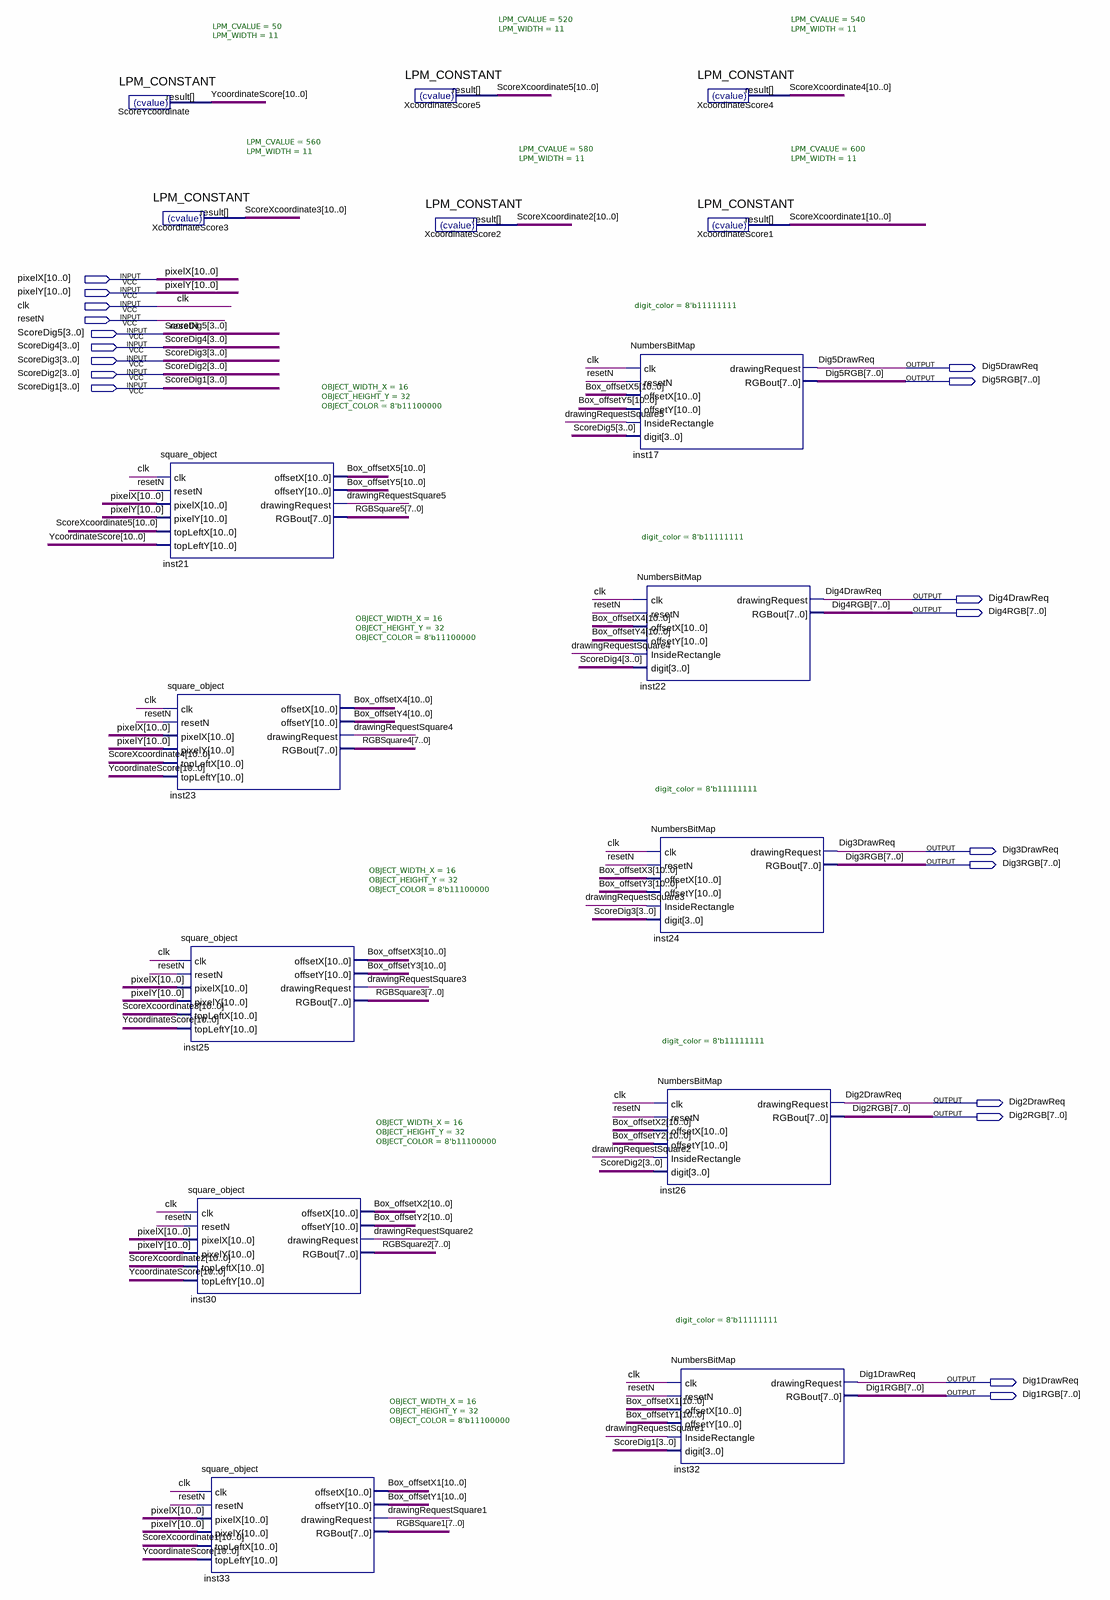
[diagram p0: schematic sheet]
// Quartus schematic Score_Block.bdf as structural Verilog: 16 symbols, 19 pins
module Score_Block (
  input  [10:0] pixelX,
  input  [10:0] pixelY,
  input  clk,
  input  resetN,
  input  [3:0] ScoreDig5,
  input  [3:0] ScoreDig4,
  input  [3:0] ScoreDig3,
  input  [3:0] ScoreDig2,
  input  [3:0] ScoreDig1,
  output Dig5DrawReq,
  output [7:0] Dig5RGB,
  output Dig4DrawReq,
  output [7:0] Dig4RGB,
  output Dig3DrawReq,
  output [7:0] Dig3RGB,
  output Dig2DrawReq,
  output [7:0] Dig2RGB,
  output Dig1DrawReq,
  output [7:0] Dig1RGB
);

  wire drawingRequestSquare1, drawingRequestSquare2, drawingRequestSquare3, drawingRequestSquare4,
       drawingRequestSquare5;
  wire [7:0] RGBSquare1, RGBSquare2, RGBSquare3, RGBSquare4, RGBSquare5;
  wire [10:0] Box_offsetX1, Box_offsetX2, Box_offsetX3, Box_offsetX4, Box_offsetX5, Box_offsetY1,
       Box_offsetY2, Box_offsetY3, Box_offsetY4, Box_offsetY5, ScoreXcoordinate1, ScoreXcoordinate2,
       ScoreXcoordinate3, ScoreXcoordinate4, ScoreXcoordinate5, YcoordinateScore;

  LPM_CONSTANT #(.LPM_CVALUE(50), .LPM_WIDTH(11)) ScoreYcoordinate (.result(YcoordinateScore));
  LPM_CONSTANT #(.LPM_CVALUE(560), .LPM_WIDTH(11)) XcoordinateScore3 (.result(ScoreXcoordinate3));
  square_object #(.OBJECT_WIDTH_X(16), .OBJECT_HEIGHT_Y(32), .OBJECT_COLOR(8'b11100000)) inst21 (
    .clk(clk), .resetN(resetN), .pixelX(pixelX), .pixelY(pixelY), .topLeftX(ScoreXcoordinate5),
    .topLeftY(YcoordinateScore), .offsetX(Box_offsetX5), .offsetY(Box_offsetY5),
    .drawingRequest(drawingRequestSquare5), .RGBout(RGBSquare5));
  square_object #(.OBJECT_WIDTH_X(16), .OBJECT_HEIGHT_Y(32), .OBJECT_COLOR(8'b11100000)) inst23 (
    .clk(clk), .resetN(resetN), .pixelX(pixelX), .pixelY(pixelY), .topLeftX(ScoreXcoordinate4),
    .topLeftY(YcoordinateScore), .offsetX(Box_offsetX4), .offsetY(Box_offsetY4),
    .drawingRequest(drawingRequestSquare4), .RGBout(RGBSquare4));
  square_object #(.OBJECT_WIDTH_X(16), .OBJECT_HEIGHT_Y(32), .OBJECT_COLOR(8'b11100000)) inst25 (
    .clk(clk), .resetN(resetN), .pixelX(pixelX), .pixelY(pixelY), .topLeftX(ScoreXcoordinate3),
    .topLeftY(YcoordinateScore), .offsetX(Box_offsetX3), .offsetY(Box_offsetY3),
    .drawingRequest(drawingRequestSquare3), .RGBout(RGBSquare3));
  square_object #(.OBJECT_WIDTH_X(16), .OBJECT_HEIGHT_Y(32), .OBJECT_COLOR(8'b11100000)) inst30 (
    .clk(clk), .resetN(resetN), .pixelX(pixelX), .pixelY(pixelY), .topLeftX(ScoreXcoordinate2),
    .topLeftY(YcoordinateScore), .offsetX(Box_offsetX2), .offsetY(Box_offsetY2),
    .drawingRequest(drawingRequestSquare2), .RGBout(RGBSquare2));
  square_object #(.OBJECT_WIDTH_X(16), .OBJECT_HEIGHT_Y(32), .OBJECT_COLOR(8'b11100000)) inst33 (
    .clk(clk), .resetN(resetN), .pixelX(pixelX), .pixelY(pixelY), .topLeftX(ScoreXcoordinate1),
    .topLeftY(YcoordinateScore), .offsetX(Box_offsetX1), .offsetY(Box_offsetY1),
    .drawingRequest(drawingRequestSquare1), .RGBout(RGBSquare1));
  LPM_CONSTANT #(.LPM_CVALUE(520), .LPM_WIDTH(11)) XcoordinateScore5 (.result(ScoreXcoordinate5));
  LPM_CONSTANT #(.LPM_CVALUE(580), .LPM_WIDTH(11)) XcoordinateScore2 (.result(ScoreXcoordinate2));
  NumbersBitMap #(.digit_color(8'b11111111)) inst17 (
    .clk(clk), .resetN(resetN), .offsetX(Box_offsetX5), .offsetY(Box_offsetY5),
    .InsideRectangle(drawingRequestSquare5), .digit(ScoreDig5), .drawingRequest(Dig5DrawReq), .RGBout(Dig5RGB));
  NumbersBitMap #(.digit_color(8'b11111111)) inst22 (
    .clk(clk), .resetN(resetN), .offsetX(Box_offsetX4), .offsetY(Box_offsetY4),
    .InsideRectangle(drawingRequestSquare4), .digit(ScoreDig4), .drawingRequest(Dig4DrawReq), .RGBout(Dig4RGB));
  NumbersBitMap #(.digit_color(8'b11111111)) inst24 (
    .clk(clk), .resetN(resetN), .offsetX(Box_offsetX3), .offsetY(Box_offsetY3),
    .InsideRectangle(drawingRequestSquare3), .digit(ScoreDig3), .drawingRequest(Dig3DrawReq), .RGBout(Dig3RGB));
  NumbersBitMap #(.digit_color(8'b11111111)) inst26 (
    .clk(clk), .resetN(resetN), .offsetX(Box_offsetX2), .offsetY(Box_offsetY2),
    .InsideRectangle(drawingRequestSquare2), .digit(ScoreDig2), .drawingRequest(Dig2DrawReq), .RGBout(Dig2RGB));
  NumbersBitMap #(.digit_color(8'b11111111)) inst32 (
    .clk(clk), .resetN(resetN), .offsetX(Box_offsetX1), .offsetY(Box_offsetY1),
    .InsideRectangle(drawingRequestSquare1), .digit(ScoreDig1), .drawingRequest(Dig1DrawReq), .RGBout(Dig1RGB));
  LPM_CONSTANT #(.LPM_CVALUE(540), .LPM_WIDTH(11)) XcoordinateScore4 (.result(ScoreXcoordinate4));
  LPM_CONSTANT #(.LPM_CVALUE(600), .LPM_WIDTH(11)) XcoordinateScore1 (.result(ScoreXcoordinate1));
endmodule
